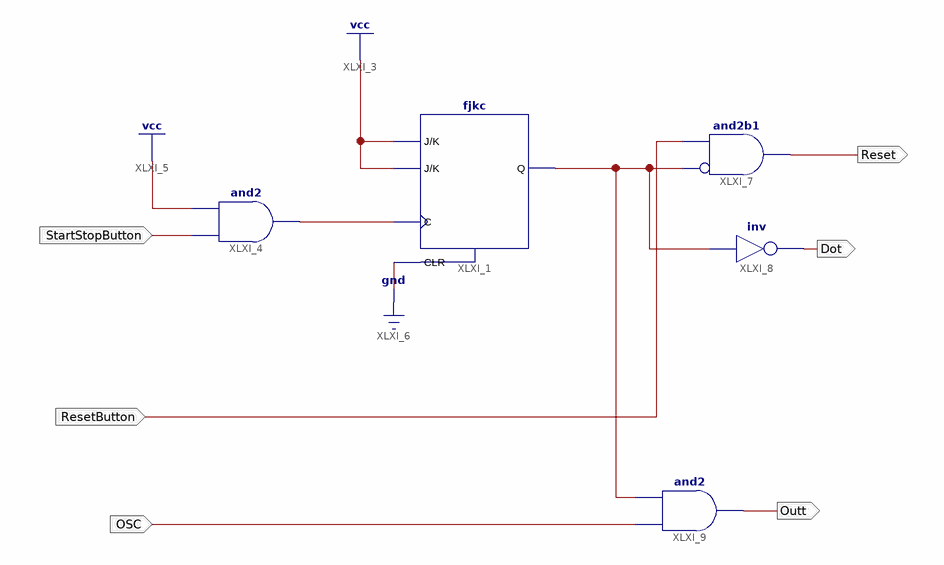
[diagram p0: schematic sheet 1]
// Xilinx ISE schematic ClockState.sch (spartan6) as structural Verilog: 5 symbols, 6 ports
module ClockState (
  input  StartStopButton,
  input  ResetButton,
  input  OSC,
  output Reset,
  output Dot,
  output Outt
);

  wire XLXN_2, XLXN_14;

  fjkc XLXI_1 (.C(XLXN_2), .CLR(1'b0), .J(1'b1), .K(1'b1), .Q(XLXN_14));
  and XLXI_4 (XLXN_2, StartStopButton, 1'b1);
  and XLXI_7 (Reset, ~XLXN_14, ResetButton);  // and2b1
  not XLXI_8 (Dot, XLXN_14);
  and XLXI_9 (Outt, OSC, XLXN_14);
endmodule
